# Altium project amino.PrjPcb (part 1 of 2)
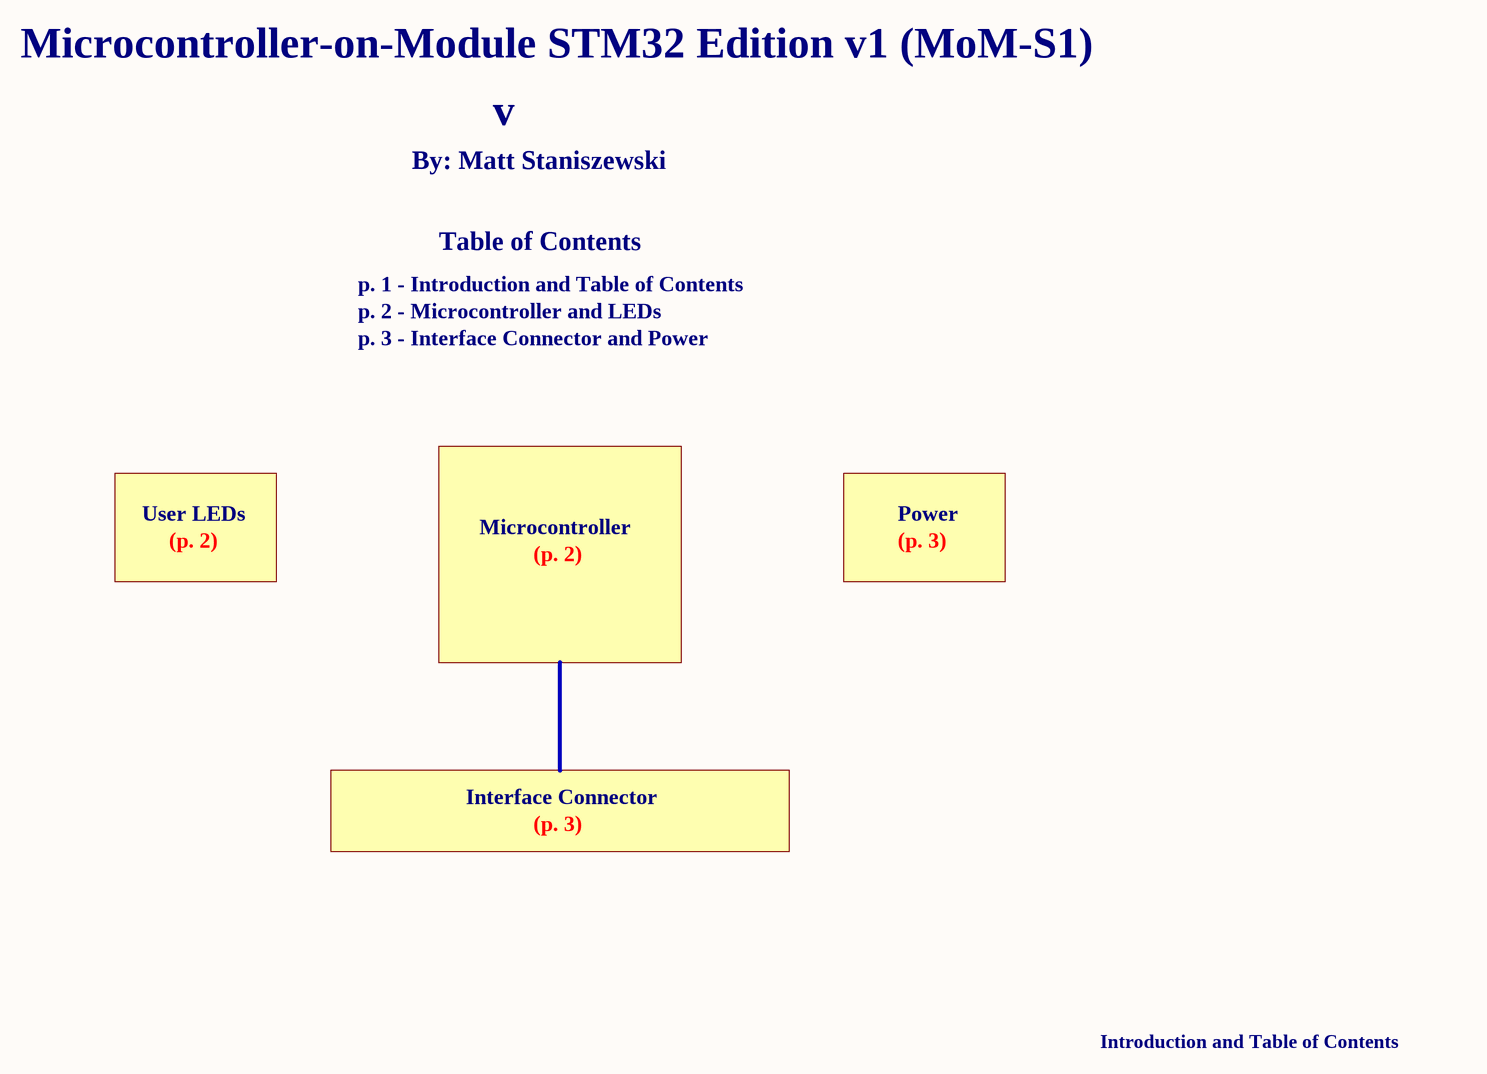
[diagram p0: p1_title_toc.SchDoc]
ProjEngineer: Matt Staniszewski; ProjRev: 1.0.3; XPN: amINO
3 sheets, 78 parts. Net scope: global (net labels, ports and power ports of the same name join across sheets).
Board file: amino.PcbDoc
Sheets:
  p1_title_toc.SchDoc
  p2_mcu_ble.SchDoc
  p3_intf_conn_pwr.SchDoc

## Sheet p1_title_toc.SchDoc
size OrCAD B; DocumentNumber: 1; SheetNumber: 1; SheetTotal: 3

### Notes on the sheet
- Microcontroller-on-Module STM32 Edition v1 (MoM-S1)
- By: Matt Staniszewski
- v
- p. 1 - Introduction and Table of Contents
- Table of Contents
- p. 2 - Microcontroller and LEDs
- p. 3 - Interface Connector and Power
- User LEDs
- (p. 2)
- Microcontroller
- Power
- (p. 3)
- Interface Connector
- Introduction and Table of Contents

## Sheet p2_mcu_ble.SchDoc
size OrCAD B; DocumentNumber: 2; SheetNumber: 2; SheetTotal: 3
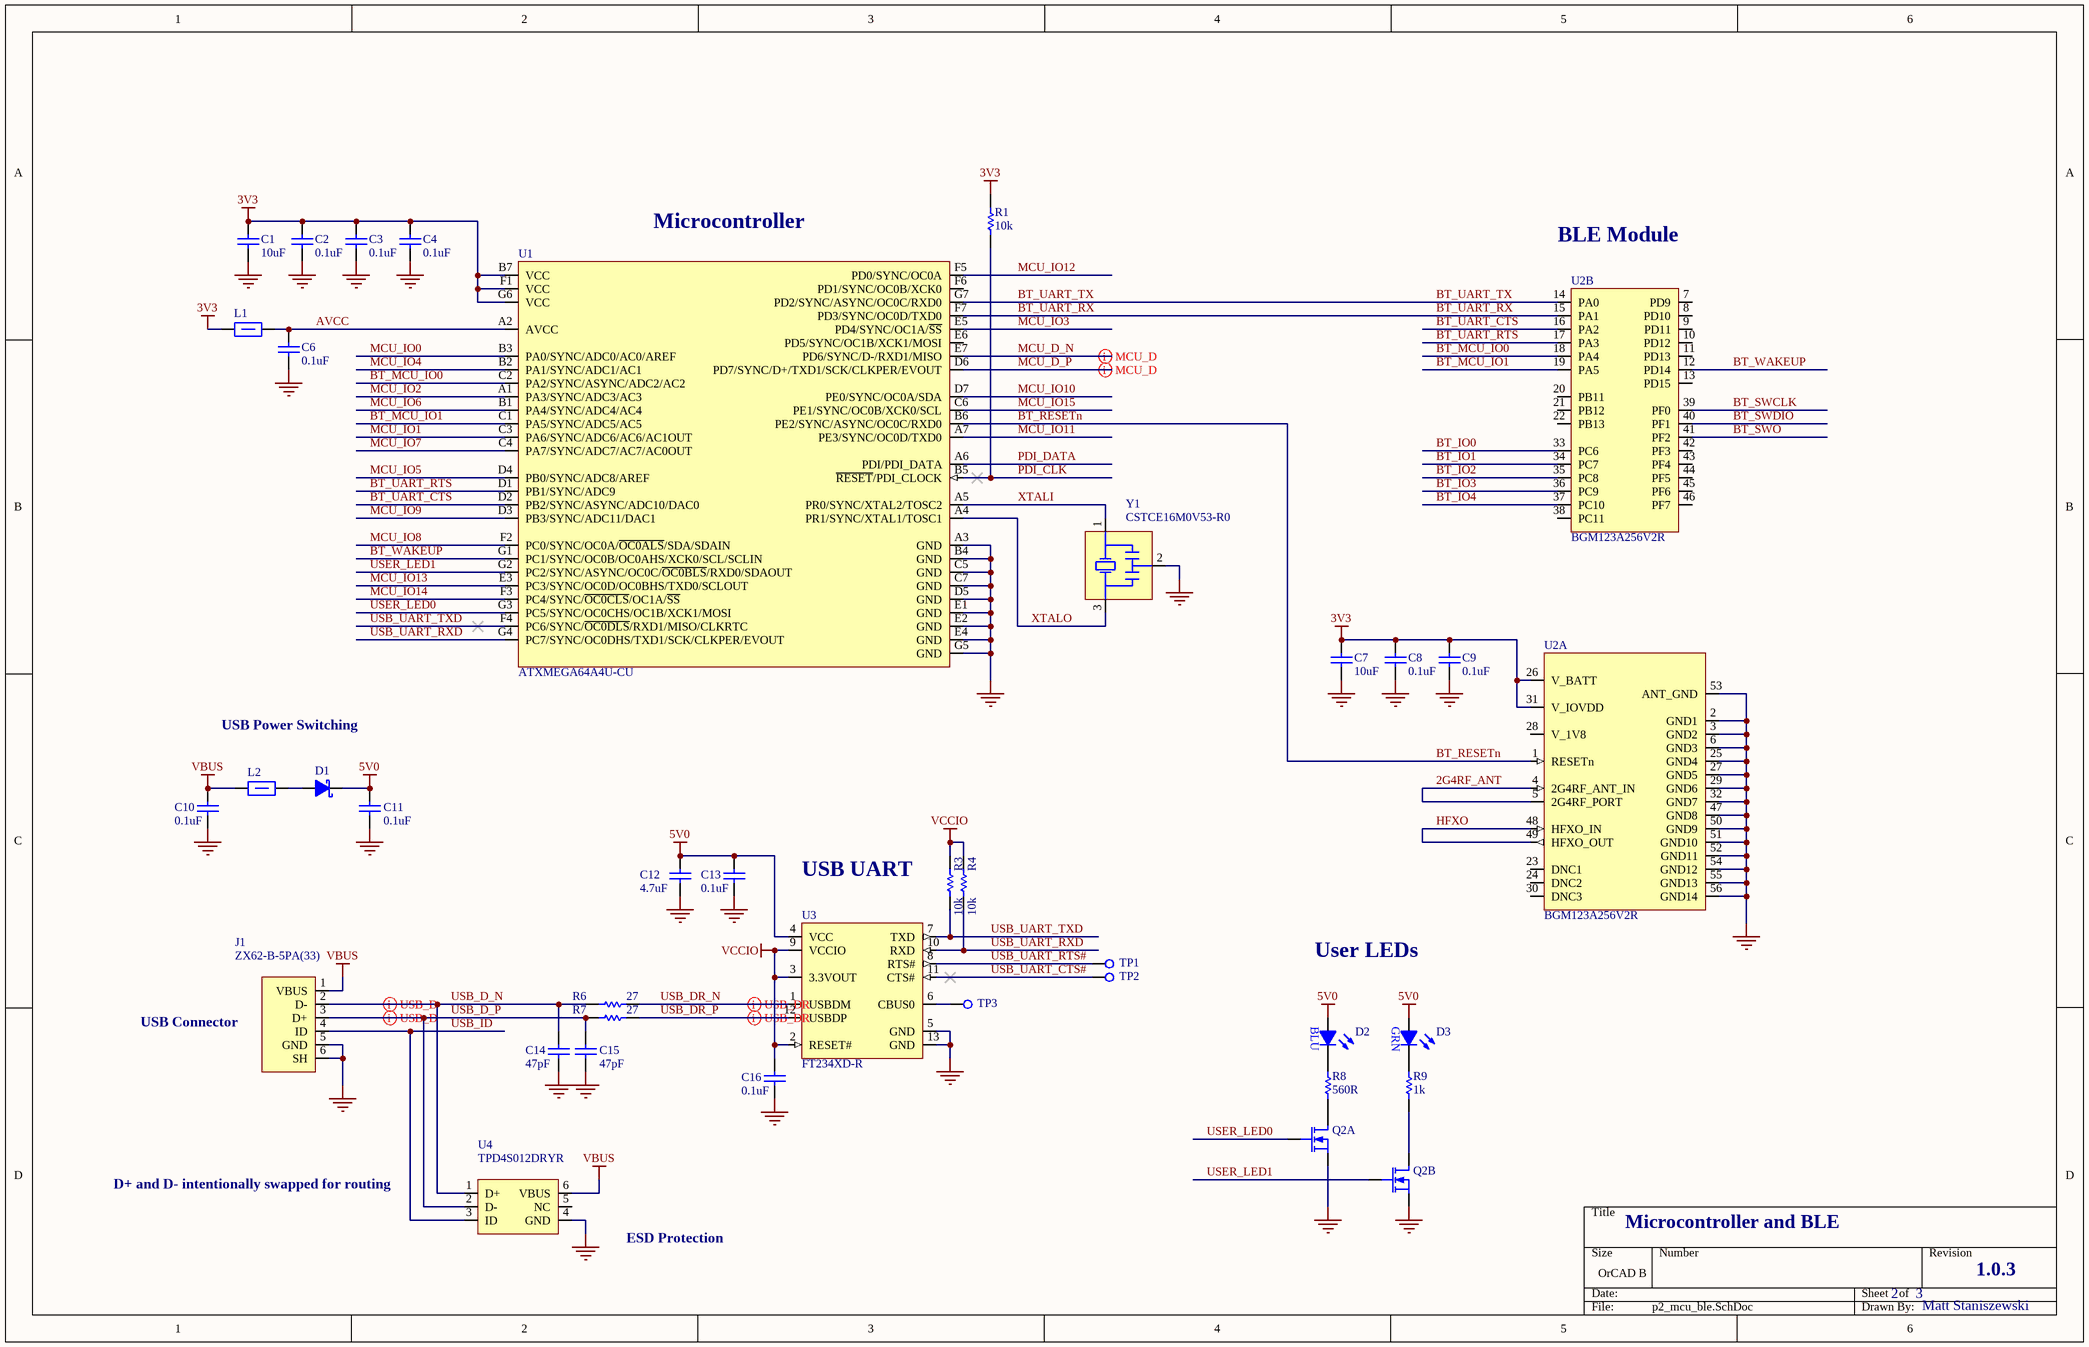
[diagram p1: p2_mcu_ble.SchDoc]

### Parts
(Parts that share a designator on the sheet are numbered #1, #2 ... from top to bottom, then left to right.)
C1  10uF  [C0402]
C2  0.1uF  [C0201]
C3  0.1uF  [C0201]
C4  0.1uF  [C0201]
C6  0.1uF  [C0201]
C7  10uF  [C0402]
C8  0.1uF  [C0201]
C9#1  0.1uF  [C0201]
C10#1  0.1uF  [C0201]
C11#1  0.1uF  [C0201]
C12#1  4.7uF  [C0402]
C13#1  0.1uF  [C0201]
C14#1  47pF  [C0201]
C15  47pF  [C0201]
C16  0.1uF  [C0201]
D1  PMEG2020EPK,315  [NXP_DFN1608D-2]  (value not drawn)
D2  5988091107F  [LED0603]  (value not drawn)
D3#1  5988070107F  [LED0603]  (value not drawn)
J1#1  ZX62-B-5PA(33)  [HRS_MICRO_USB]
L1  BLM15PX601SN1D  [L0402]  (value not drawn)
L2  BLM15PX601SN1D  [L0402]  (value not drawn)
Q2#1  PMDXB600UNE  [NXP_DFN1010B-6]  (value not drawn)  (parts A,B of 2)
R1  10k  [R0201]
R3  10k  [R0201]
R4#1  10k  [R0201]
R6  27  [R0201]
R7  27  [R0201]
R8  560R  [R0201]
R9#1  1k  [R0201]
TP1#1  TP SMT 0.5MM  [TP_SMT_0.5MM]  (value not drawn)
TP2#1  TP SMT 0.5MM  [TP_SMT_0.5MM]  (value not drawn)
TP3#1  TP SMT 0.5MM  [TP_SMT_0.5MM]  (value not drawn)
U1  ATXMEGA64A4U-CU  [MCP_49C2]
U2#1  BGM123A256V2R  [SIL_BGM123]  (parts A,B of 2)
U3#1  FT234XD-R  [FTD_DFN12]
U4  TPD4S012DRYR  [TI_DRY]
Y1  CSTCE16M0V53-R0  [MUR_CSTCE_V]

### Nets
3V3: C1.2 C2.2 C3.2 C4.2 C7.2 C8.2 C9#1.2 L1.1 R1.2 U1.B7(VCC) U1.F1(VCC) U1.G6(VCC) U2#1.26(V_BATT) U2#1.31(V_IOVDD)
5V0: C11#1.2 C12#1.2 C13#1.2 D1.1(K) D2.2(A) D3#1.2(A) U3#1.4(VCC)
GND: C1.1 C2.1 C3.1 C4.1 C6.1 C7.1 C8.1 C9#1.1 C10#1.1 C11#1.1 C12#1.1 C13#1.1 C14#1.1 C15.1 C16.1 J1#1.5(GND) J1#1.6(SH) Q2#1.1(S1) Q2#1.4(S2) U1.A3(GND) U1.B4(GND) U1.C5(GND) U1.C7(GND) U1.D5(GND) U1.E1(GND) U1.E2(GND) U1.E4(GND) U1.G5(GND) U2#1.2(GND1) U2#1.3(GND2) U2#1.6(GND3) U2#1.25(GND4) U2#1.27(GND5) U2#1.29(GND6) U2#1.32(GND7) U2#1.47(GND8) U2#1.50(GND9) U2#1.51(GND10) U2#1.52(GND11) U2#1.53(ANT_GND) U2#1.54(GND12) U2#1.55(GND13) U2#1.56(GND14) U3#1.5(GND) U3#1.13(GND) U4.4(GND) Y1.2
VBUS: C10#1.2 J1#1.1(VBUS) L2.1 U4.6(VBUS)
VCCIO: C16.2 R3.2 R4#1.2 U3#1.2(RESET#) U3#1.3(3.3VOUT) U3#1.9(VCCIO)
2G4RF_ANT: U2#1.4(2G4RF_ANT_IN) U2#1.5(2G4RF_PORT)
AVCC: C6.2 L1.2 U1.A2(AVCC)
BT_IO0: U2#1.33(PC6)
BT_IO1: U2#1.34(PC7)
BT_IO2: U2#1.35(PC8)
BT_IO3: U2#1.36(PC9)
BT_IO4: U2#1.37(PC10)
BT_MCU_IO0: U1.C2(PA2/SYNC/ASYNC/ADC2/AC2) U2#1.18(PA4)
BT_MCU_IO1: U1.C1(PA5/SYNC/ADC5/AC5) U2#1.19(PA5)
BT_RESETn: U1.B6(PE2/SYNC/ASYNC/OC0C/RXD0) U2#1.1(RESETn)
BT_SWCLK: U2#1.39(PF0)
BT_SWDIO: U2#1.40(PF1)
BT_SWO: U2#1.41(PF2)
BT_UART_CTS: U1.D2(PB2/SYNC/ASYNC/ADC10/DAC0) U2#1.16(PA2)
BT_UART_RTS: U1.D1(PB1/SYNC/ADC9) U2#1.17(PA3)
BT_UART_RX: U1.F7(PD3/SYNC/OC0D/TXD0) U2#1.15(PA1)
BT_UART_TX: U1.G7(PD2/SYNC/ASYNC/OC0C/RXD0) U2#1.14(PA0)
BT_WAKEUP: U1.G1(PC1/SYNC/OC0B/OC0AHS/XCK0/SCL/SCLIN) U2#1.12(PD14)
HFXO: U2#1.48(HFXO_IN) U2#1.49(HFXO_OUT)
MCU_D_N: U1.E7(PD6/SYNC/D-/RXD1/MISO)
MCU_D_P: U1.D6(PD7/SYNC/D+/TXD1/SCK/CLKPER/EVOUT)
MCU_IO0: U1.B3(PA0/SYNC/ADC0/AC0/AREF)
MCU_IO1: U1.C3(PA6/SYNC/ADC6/AC6/AC1OUT)
MCU_IO2: U1.A1(PA3/SYNC/ADC3/AC3)
MCU_IO3: U1.E5(PD4/SYNC/OC1A/~{SS})
MCU_IO4: U1.B2(PA1/SYNC/ADC1/AC1)
MCU_IO5: U1.D4(PB0/SYNC/ADC8/AREF)
MCU_IO6: U1.B1(PA4/SYNC/ADC4/AC4)
MCU_IO7: U1.C4(PA7/SYNC/ADC7/AC7/AC0OUT)
MCU_IO8: U1.F2(PC0/SYNC/OC0A/~{OC0ALS}/SDA/SDAIN)
MCU_IO9: U1.D3(PB3/SYNC/ADC11/DAC1)
MCU_IO10: U1.D7(PE0/SYNC/OC0A/SDA)
MCU_IO11: U1.A7(PE3/SYNC/OC0D/TXD0)
MCU_IO12: U1.F5(PD0/SYNC/OC0A)
MCU_IO13: U1.E3(PC3/SYNC/OC0D/OC0BHS/TXD0/SCLOUT)
MCU_IO14: U1.F3(PC4/SYNC/~{OC0CLS}/OC1A/~{SS})
MCU_IO15: U1.C6(PE1/SYNC/OC0B/XCK0/SCL)
PDI_CLK: R1.1 U1.B5(~{RESET}/PDI_CLOCK)
PDI_DATA: U1.A6(PDI/PDI_DATA)
USB_D_N: C14#1.2 J1#1.2(D-) R6.1 U4.1(D+)
USB_D_P: C15.2 J1#1.3(D+) R7.1 U4.2(D-)
USB_DR_N: R6.2 U3#1.1(USBDM)
USB_DR_P: R7.2 U3#1.12(USBDP)
USB_ID: J1#1.4(ID) U4.3(ID)
USB_UART_CTS#: TP2#1.1 U3#1.11(CTS#)
USB_UART_RTS#: TP1#1.1 U3#1.8(RTS#)
USB_UART_RXD: R4#1.1 U1.G4(PC7/SYNC/OC0DHS/TXD1/SCK/CLKPER/EVOUT) U3#1.10(RXD)
USB_UART_TXD: R3.1 U1.F4(PC6/SYNC/~{OC0DLS}/RXD1/MISO/CLKRTC) U3#1.7(TXD)
USER_LED0: Q2#1.2(G1) U1.G3(PC5/SYNC/OC0CHS/OC1B/XCK1/MOSI)
USER_LED1: Q2#1.5(G2) U1.G2(PC2/SYNC/ASYNC/OC0C/~{OC0BLS}/RXD0/SDAOUT)
XTALI: U1.A5(PR0/SYNC/XTAL2/TOSC2) Y1.1
XTALO: U1.A4(PR1/SYNC/XTAL1/TOSC1) Y1.3
NetD1_2: D1.2(A) L2.2
NetD2_1: D2.1(K) R8.2
NetD3#1_1: D3#1.1(K) R9#1.2
NetQ2#1_3: Q2#1.3(S2) R9#1.1
NetQ2#1_6: Q2#1.6(D1) R8.1
NetTP3#1_1: TP3#1.1 U3#1.6(CBUS0)

Not connected (* = marked no-connect by the designer): U1 E6(PD5/SYNC/OC1B/XCK1/MOSI) F6(PD1/SYNC/OC0B/XCK0); U2#1 7(PD9) 8(PD10) 9(PD11) 10(PD12) 11(PD13) 13(PD15) 20(PB11) 21(PB12) 22(PB13) 23(DNC1) 24(DNC2) 28(V_1V8) 30(DNC3) 38(PC11) 42(PF3) 43(PF4) 44(PF5) 45(PF6) 46(PF7); U4 5(NC)

### Layout directives
differential pair: MCU_D_N, MCU_D_P, USB_D_N, USB_D_P, USB_DR_N, USB_DR_P

### Notes on the sheet
- (near U1) Microcontroller
- BLE Module
- USB Power Switching
- USB UART
- User LEDs
- USB Connector
- (near U4) D+ and D- intentionally swapped for routing
- Microcontroller and BLE
- ESD Protection
- (in symbol Blue 0603 LED) BLU
- (in symbol Green 0603 LED) GRN

### Library data of the parts
C1 C7 = 10uF 10V 0402: CAP CER 10UF 10V X5R 0402; Manufacturer: Samsung; Manufacturer Part Number: CL05A106MP5NUNC; Tolerance: 20%; Supplier 1: Digi-Key; Stock 1: 2282441; Pricing 1: 1=0.4, 10=0.277, 100=0.1663, 500=0.1247, 1000=0.1053, 2500=0.0998, 5000=0.0943 (USD); Mount: Surface Mount; Case/Package: 0402; Case Code (Metric): 1005; Case Code (Imperial): 0402; Contact Plating: Nickel,Tin; Min Operating Temperature: -55°C; Max Operating Temperature: 85°C; Package Quantity: 1; Packaging: Tape and Reel; Capacitance: 10uF; Voltage Rating: 10V; Dielectric: X5R; Termination: Wraparound; Length: 1mm; Width: 0.02inch; Thickness: 0.028inch; Depth: 0.5mm; Radiation Hardening: No; Lead Free: Lead Free; ComponentLink1URL: https://datasheet.ciiva.com/25721/cl05a106mp5nunc-25721584.pdf; ComponentLink1Description: https://datasheet.ciiva.com/25721/cl05a106mp5nunc-25721584.pdf; ComponentLink2URL: https://datasheet.ciiva.com/26838/getdatasheetpartid-745310-26838170.pdf; ComponentLink2Description: https://datasheet.ciiva.com/26838/getdatasheetpartid-745310-26838170.pdf; Supplier Part Number 1: 1276-1450-1-ND
C2-C4 C6 C8 C9#1 C10#1 C11#1 C13#1 C16 = 0.1uF 16V 0201: CAP CER 0.1UF 16V X5R 0201; Manufacturer: Murata; Manufacturer Part Number: GRM033R61C104ME84D; Capacitance: 1E-07f; Tolerance: 20%; Supplier 1: Digi-Key; Stock 1: 660567; Pricing 1: 1=0.1, 10=0.029, 100=0.013, 500=0.0093, 1000=0.0073, 2500=0.0067, 5000=0.0061 (USD); Case/Package: 0201; Weight: 1.2E-05oz; Case Code (Metric): 0603; Case Code (Imperial): 0201; Min Operating Temperature: -55°C; Max Operating Temperature: 85°C; Packaging: Tape and Reel; Voltage Rating: 16V; Dielectric: X5R; Termination: SMD/SMT; Voltage Rating (DC): 16V; Package Quantity: 15000; Length: 0.024inch; Height: 0.3mm; Width: 0.3mm; Thickness: 0.013inch; ComponentLink1URL: http://www.mouser.com/ds/2/281/c02e-2905.pdf; ComponentLink1Description: http://www.mouser.com/ds/2/281/c02e-2905.pdf; Supplier Part Number 1: 490-9986-1-ND
C12#1 = 4.7uF 16V 0402: CAP CER 4.7UF 16V X5R 0402; Manufacturer: Samsung; Manufacturer Part Number: CL05A475MO5NUNC; Tolerance: 20%; Supplier 1: Digi-Key; Stock 1: 282710; Pricing 1: 1=0.36, 10=0.248, 100=0.1485, 500=0.1114, 1000=0.0941, 2500=0.0891, 5000=0.0842 (USD); Case/Package: 0402; Case Code (Metric): 1005; Case Code (Imperial): 0402; Min Operating Temperature: -55°C; Max Operating Temperature: 85°C; Packaging: Tape and Reel; Capacitance: 4.7uF; Voltage Rating: 16V; Dielectric: X5R; Length: 0.039inch; Width: 0.02inch; Thickness: 0.022inch; Supplier Part Number 1: 1276-6836-1-ND
C14#1 C15 = 47pF 25V 0201: CAP CER 47PF 25V C0G/NP0 0201; Manufacturer: Murata; Manufacturer Part Number: GRM0335C1E470FA01D; Tolerance: 1%; Supplier 1: Digi-Key; Stock 1: 97008; Pricing 1: 1=0.1, 10=0.019, 100=0.0087, 500=0.0062, 1000=0.0049, 2500=0.0044, 5000=0.0041 (USD); Case/Package: 0201; Case Code (Metric): 0603; Case Code (Imperial): 0201; Min Operating Temperature: -55°C; Max Operating Temperature: 125°C; Capacitance: 47pF; Packaging: Tape and Reel; Voltage Rating: 25V; Package Quantity: 15000; Termination: SMD/SMT; Voltage Rating (DC): 25V; Length: 0.024inch; Width: 0.012inch; Thickness: 0.013inch; ComponentLink1URL: https://datasheet.ciiva.com/29538/partnumbering-e-01-29538333.pdf; ComponentLink1Description: https://datasheet.ciiva.com/29538/partnumbering-e-01-29538333.pdf; Supplier Part Number 1: 490-11298-1-ND
D1 = PMEG2020EPK,315: DIODE SCHOTTKY 20V 2A 2DFN; Manufacturer: NXP Semiconductors; Max Power Dissipation: 1.565W; Peak Reverse Current: 70uA; Reverse Recovery Time: 5ns; Natural Thermal Resistance: 20°C/W; Forward Voltage: 395mV; Max Forward Surge Current (Ifsm): 5A; Element Configuration: Single; Supplier 1: Digi-Key; Manufacturer Part Number: PMEG2020EPK,315; Stock 1: 146420; Pricing 1: 1=0.51, 10=0.387, 100=0.2411, 500=0.165, 1000=0.1269 (USD); Mount: Surface Mount; Case/Package: SMD/SMT; Number of Pins: 2; Min Operating Temperature: -55°C; Max Operating Temperature: 150°C; Package Quantity: 8000; Packaging: Tape and Reel; Forward Current: 2A; Reverse Voltage (DC): 20V; Average Rectified Current: 2A; Max Repetitive Reverse Voltage (Vrrm): 20V; Peak Non-Repetitive Surge Current: 5A; Radiation Hardening: No; ComponentLink1URL: https://datasheet.ciiva.com/29592/pmeg2020epk-29592900.pdf; ComponentLink1Description: https://datasheet.ciiva.com/29592/pmeg2020epk-29592900.pdf; ComponentLink2URL: https://datasheet.ciiva.com/29592/pmeg2020epk-29592901.pdf; ComponentLink2Description: https://datasheet.ciiva.com/29592/pmeg2020epk-29592901.pdf; ComponentLink3URL: https://datasheet.ciiva.com/24111/pmeg2020epk-268880-24111063.pdf; ComponentLink3Description: https://datasheet.ciiva.com/24111/pmeg2020epk-268880-24111063.pdf; ComponentLink4URL: https://datasheet.ciiva.com/25648/pmeg2020epk-25648600.pdf; ComponentLink4Description: https://datasheet.ciiva.com/25648/pmeg2020epk-25648600.pdf; Supplier Part Number 1: 1727-1338-1-ND
D2 = Blue 0603 LED: LED BLUE CLEAR 0603 SMD; Manufacturer: Dialight; Manufacturer Part Number: 598-8091-107F; Lens Colour: Clear,Colorless; Wavelength: 475nm; Luminous Intensity: 140mcd; Viewing Angle: 140°; Forward Voltage: 3.2V; Lens Style: Clear,Diffused,Colorless,Rectangular; Forward Current: 20mA; Dominant Wavelength: 470nm; Number of Elements: 1; Power Dissipation: 70mW; Supplier 1: Digi-Key; Stock 1: 42042; Pricing 1: 1=0.75, 10=0.583, 25=0.4864, 100=0.4189, 250=0.374, 500=0.3216, 1000=0.2483 (USD); Mount: Surface Mount; Case/Package: 0603; Number of Pins: 2; Colour: Blue; Case Code (Metric): 1608; Case Code (Imperial): 0603; Min Operating Temperature: -30°C; Max Operating Temperature: 100°C; Packaging: Tape and Reel; Package Quantity: 4000; Illumination Colour: Blue; Lens Transparency: Clear; Test Current: 20mA; Number of LEDs: 1; Length: 1.6mm; Height: 0.7mm; Width: 0.8mm; Depth: 0.8mm; Radiation Hardening: No; REACH SVHC: No SVHC; Lead Free: Lead Free; ComponentLink1URL: https://datasheet.ciiva.com/15118/getdatasheetpartid-194139-15118048.pdf; ComponentLink1Description: https://datasheet.ciiva.com/15118/getdatasheetpartid-194139-15118048.pdf; ComponentLink2URL: https://datasheet.ciiva.com/2111/598-series-0603-pkg-2111556.pdf; ComponentLink2Description: https://datasheet.ciiva.com/2111/598-series-0603-pkg-2111556.pdf; ComponentLink3URL: https://datasheet.ciiva.com/2111/598-series-0603-pkg-2111557.pdf; ComponentLink3Description: https://datasheet.ciiva.com/2111/598-series-0603-pkg-2111557.pdf; ComponentLink4URL: https://datasheet.ciiva.com/15965/mdei5980603-15965445.pdf; ComponentLink4Description: https://datasheet.ciiva.com/15965/mdei5980603-15965445.pdf; ComponentLink5URL: https://datasheet.ciiva.com/30240/mdei5980603-30240533.pdf; ComponentLink5Description: https://datasheet.ciiva.com/30240/mdei5980603-30240533.pdf; ComponentLink6URL: https://datasheet.ciiva.com/2111/598-series-0603-pkg-2111558.pdf; ComponentLink6Description: https://datasheet.ciiva.com/2111/598-series-0603-pkg-2111558.pdf; ComponentLink7URL: https://datasheet.ciiva.com/7970/25658-7970182.pdf; ComponentLink7Description: https://datasheet.ciiva.com/7970/25658-7970182.pdf; ComponentLink8URL: https://datasheet.ciiva.com/14603/70081992-14603963.pdf; ComponentLink8Description: https://datasheet.ciiva.com/14603/70081992-14603963.pdf; ComponentLink9URL: https://datasheet.ciiva.com/16400/smt-selector-guide-16400478.pdf; ComponentLink9Description: https://datasheet.ciiva.com/16400/smt-selector-guide-16400478.pdf; Supplier Part Number 1: 350-2037-1-ND
D3#1 = Green 0603 LED: LED GREEN CLEAR 0603 SMD; Manufacturer: Dialight; Manufacturer Part Number: 598-8070-107F; Wavelength: 570nm; Luminous Intensity: 20mcd; Viewing Angle: 140°; Forward Voltage: 2V; Lens Style: Clear,Diffused,Colorless,Rectangular; Forward Current: 20mA; Dominant Wavelength: 568nm; Number of Elements: 1; Power Dissipation: 60mW; Supplier 1: Digi-Key; Stock 1: 147636; Pricing 1: 1=0.45, 10=0.327, 25=0.2504, 100=0.1634, 250=0.1198, 500=0.1016, 1000=0.0835 (USD); Mount: Surface Mount; Case/Package: 0603; Number of Pins: 2; Colour: Green; Case Code (Metric): 1608; Case Code (Imperial): 0603; Lens Colour: Clear; Min Operating Temperature: -30°C; Max Operating Temperature: 100°C; Packaging: Tape and Reel; Package Quantity: 4000; Illumination Colour: Green; Test Current: 20mA; Number of LEDs: 1; Length: 1.6mm; Height: 0.7mm; Width: 0.8mm; Depth: 0.8mm; Radiation Hardening: No; REACH SVHC: No SVHC; Lead Free: Lead Free; ComponentLink1URL: https://datasheet.ciiva.com/4688/598-selectorguide-18902-4688880.pdf; ComponentLink1Description: https://datasheet.ciiva.com/4688/598-selectorguide-18902-4688880.pdf; ComponentLink2URL: https://datasheet.ciiva.com/11774/0900766b80ae2975-11774257.pdf; ComponentLink2Description: https://datasheet.ciiva.com/11774/0900766b80ae2975-11774257.pdf; ComponentLink3URL: https://datasheet.ciiva.com/1243/1484480-1243893.pdf; ComponentLink3Description: https://datasheet.ciiva.com/1243/1484480-1243893.pdf; ComponentLink4URL: https://datasheet.ciiva.com/2110/598-series-0603-pkg-2110165.pdf; ComponentLink4Description: https://datasheet.ciiva.com/2110/598-series-0603-pkg-2110165.pdf; ComponentLink5URL: https://datasheet.ciiva.com/1243/1484480-1243894.pdf; ComponentLink5Description: https://datasheet.ciiva.com/1243/1484480-1243894.pdf; ComponentLink6URL: https://datasheet.ciiva.com/2110/598-series-0603-pkg-2110166.pdf; ComponentLink6Description: https://datasheet.ciiva.com/2110/598-series-0603-pkg-2110166.pdf; ComponentLink7URL: https://datasheet.ciiva.com/2110/598-series-0603-pkg-2110167.pdf; ComponentLink7Description: https://datasheet.ciiva.com/2110/598-series-0603-pkg-2110167.pdf; ComponentLink8URL: https://datasheet.ciiva.com/14605/70081990-14605530.pdf; ComponentLink8Description: https://datasheet.ciiva.com/14605/70081990-14605530.pdf; ComponentLink9URL: https://datasheet.ciiva.com/15965/mdei5980603-15965419.pdf; ComponentLink9Description: https://datasheet.ciiva.com/15965/mdei5980603-15965419.pdf; ComponentLink10URL: https://datasheet.ciiva.com/30188/mdei5980603-30188139.pdf; ComponentLink10Description: https://datasheet.ciiva.com/30188/mdei5980603-30188139.pdf; ComponentLink11URL: https://datasheet.ciiva.com/15117/getdatasheetpartid-146438-15117836.pdf; ComponentLink11Description: https://datasheet.ciiva.com/15117/getdatasheetpartid-146438-15117836.pdf; ComponentLink12URL: https://datasheet.ciiva.com/22749/1484480-22749228.pdf; ComponentLink12Description: https://datasheet.ciiva.com/22749/1484480-22749228.pdf; ComponentLink13URL: https://datasheet.ciiva.com/16400/smt-selector-guide-16400463.pdf; ComponentLink13Description: https://datasheet.ciiva.com/16400/smt-selector-guide-16400463.pdf; Supplier Part Number 1: 350-2035-1-ND
J1#1 = USB Micro B: CONN RCPT USB MICRO B SMD R/A; Manufacturer: Hirose; Number of Contacts: 5; Gender: Receptacle; Current Rating: 1.8A; Mating Cycles: 10000; Supplier 1: Digi-Key; Manufacturer Part Number: ZX62-B-5PA(33); Stock 1: 63782; Pricing 1: 1=0.84, 10=0.792, 25=0.7128, 50=0.6336, 100=0.6072, 250=0.5544, 500=0.528, 1000=0.4356 (USD); Contact Material: Copper; Contact Plating: Gold; Packaging: Tape and Reel; Connector Type: USB; Orientation: Right Angle; REACH SVHC: Unknown; Lead Free: Lead Free; ComponentLink1URL: http://www.farnell.com/datasheets/2060515.pdf; ComponentLink1Description: http://www.farnell.com/datasheets/2060515.pdf; Supplier Part Number 1: H125270CT-ND
L1 L2 = BLM15PX601SN1D: FERRITE BEAD 600 OHM 0402 1LN; Manufacturer: Murata; Material: Steel; Impedance: 600R; Tolerance: 25%; Current Rating: 900mA; Number of Lines: 1; DC Resistance (DCR): 230mR; Test Frequency: 100MHz; Supplier 1: Digi-Key; Manufacturer Part Number: BLM15PX601SN1D; Stock 1: 156023; Pricing 1: 1=0.15, 10=0.123, 25=0.0956, 50=0.0792, 100=0.0682, 250=0.0546, 500=0.0491, 1000=0.0409, 5000=0.0382 (USD); Case/Package: 0402; Number of Pins: 2; Case Code (Metric): 1005; Case Code (Imperial): 0402; Min Operating Temperature: -55°C; Max Operating Temperature: 125°C; Package Quantity: 10000; Packaging: Tape and Reel; Max Current Rating: 900mA; Max DC Current: 900mA; Termination: SMD/SMT; Number of Circuits: 1; Length: 1mm; Height: 0.5mm; Width: 0.5mm; Lead Free: Lead Free; ComponentLink1URL: https://datasheet.ciiva.com/41860/l0110e-41860698.pdf; ComponentLink1Description: https://datasheet.ciiva.com/41860/l0110e-41860698.pdf; ComponentLink2URL: https://datasheet.ciiva.com/41449/001172217-da-01-en-drossel-0402-600r-1-0x0-5mm-10000st-41449505.pdf; ComponentLink2Description: https://datasheet.ciiva.com/41449/001172217-da-01-en-drossel-0402-600r-1-0x0-5mm-10000st-41449505.pdf; Supplier Part Number 1: 490-9657-1-ND
Q2#1 = PMDXB600UNE: MOSFET 2N-CH 20V 0.6A 6DFN; Manufacturer: NXP Semiconductors; Rds On Max: 620mR; Input Capacitance: 21.3pF; Continuous Drain Current (ID): 600mA; Max Power Dissipation: 265mW; Threshold Voltage: 700mV; Supplier 1: Digi-Key; Manufacturer Part Number: PMDXB600UNE; Stock 1: 27879; Pricing 1: 1=0.65, 10=0.552, 100=0.4124, 500=0.324, 1000=0.2504 (USD); Case/Package: 600; Number of Pins: 6; Min Operating Temperature: -55°C; Max Operating Temperature: 150°C; Packaging: Tape and Reel; Drain to Source Voltage (Vdss): 20V; REACH SVHC: No SVHC; ComponentLink1URL: https://datasheet.ciiva.com/29589/pmdxb600une-29589931.pdf; ComponentLink1Description: https://datasheet.ciiva.com/29589/pmdxb600une-29589931.pdf; ComponentLink2URL: https://datasheet.ciiva.com/29589/pmdxb600une-29589932.pdf; ComponentLink2Description: https://datasheet.ciiva.com/29589/pmdxb600une-29589932.pdf; ComponentLink3URL: https://datasheet.ciiva.com/29589/pmdxb600une-29589933.pdf; ComponentLink3Description: https://datasheet.ciiva.com/29589/pmdxb600une-29589933.pdf; Supplier Part Number 1: 1727-1470-1-ND
R1 R3 R4#1 = 10k 0201: RES SMD 10K OHM 1% 1/20W 0201; Manufacturer: Panasonic ECG; Manufacturer Part Number: ERJ-1GEF1002C; Resistance: 10KR; Power Rating: 50mW; Voltage Rating: 25V; Temperature Coefficient: 200ppm/°C; Voltage Rating (DC): 15V; Supplier 1: Digi-Key; Stock 1: 4709989; Pricing 1: 1=0.1, 10=0.059, 100=0.024, 1000=0.0108, 2500=0.0094, 5000=0.0077 (USD); Mount: Surface Mount; Case/Package: 0201; Case Code (Metric): 0603; Case Code (Imperial): 0201; Contact Plating: Tin; Min Operating Temperature: -55°C; Max Operating Temperature: 125°C; Tolerance: 1%; Packaging: Tape and Reel; Package Quantity: 15000; Composition: Thick Film; Number of Terminations: 2; Termination: SMD/SMT; Military Standard: Not; Max Power Dissipation: 50mW; Length: 0.6mm; Height: 0.23mm; Width: 0.012inch; Depth: 0.3mm; Radiation Hardening: No; REACH SVHC: Unknown; Lead Free: Lead Free; ComponentLink1URL: https://datasheet.ciiva.com/16427/erj-1gef1002c-16427252.pdf; ComponentLink1Description: https://datasheet.ciiva.com/16427/erj-1gef1002c-16427252.pdf; ComponentLink2URL: https://datasheet.ciiva.com/30111/aoa0000ce2-30111653.pdf; ComponentLink2Description: https://datasheet.ciiva.com/30111/aoa0000ce2-30111653.pdf; ComponentLink3URL: https://datasheet.ciiva.com/16775/70260683-16775527.pdf; ComponentLink3Description: https://datasheet.ciiva.com/16775/70260683-16775527.pdf; ComponentLink4URL: https://datasheet.ciiva.com/22785/1678796-22785991.pdf; ComponentLink4Description: https://datasheet.ciiva.com/22785/1678796-22785991.pdf; ComponentLink5URL: https://datasheet.ciiva.com/7830/1678796-7830952.pdf; ComponentLink5Description: https://datasheet.ciiva.com/7830/1678796-7830952.pdf; ComponentLink6URL: https://datasheet.ciiva.com/16770/70260683-16770095.pdf; ComponentLink6Description: https://datasheet.ciiva.com/16770/70260683-16770095.pdf; Supplier Part Number 1: P10.0KABCT-ND
R6 R7 = 27R 0201: RES SMD 27 OHM 1% 1/20W 0201; Manufacturer: Panasonic ECG; Manufacturer Part Number: ERJ-1GEF27R0C; Resistance: 27R; Temperature Coefficient: 200ppm/°C; Power Rating: 50mW; Voltage Rating: 25V; Voltage Rating (DC): 15V; Supplier 1: Digi-Key; Stock 1: 66085; Pricing 1: 1=0.1, 10=0.059, 100=0.024, 1000=0.0108, 2500=0.0094, 5000=0.0077 (USD); Mount: Surface Mount; Case/Package: 0201; Contact Plating: Tin; Case Code (Metric): 0603; Case Code (Imperial): 0201; Min Operating Temperature: -55°C; Max Operating Temperature: 125°C; Tolerance: 1%; Composition: Thick Film; Packaging: Tape and Reel; Package Quantity: 1; Number of Terminations: 2; Military Standard: Not; Max Power Dissipation: 50mW; Length: 0.6mm; Height: 0.01inch; Width: 0.012inch; Depth: 0.3mm; Radiation Hardening: No; Lead Free: Lead Free; ComponentLink1URL: https://datasheet.ciiva.com/2526/erj-g-r-e-rev08-2526739.pdf; ComponentLink1Description: https://datasheet.ciiva.com/2526/erj-g-r-e-rev08-2526739.pdf; ComponentLink2URL: https://datasheet.ciiva.com/2526/erj-g-r-e-rev08-2526740.pdf; ComponentLink2Description: https://datasheet.ciiva.com/2526/erj-g-r-e-rev08-2526740.pdf; ComponentLink3URL: https://datasheet.ciiva.com/2526/erj-g-r-e-rev08-2526741.pdf; ComponentLink3Description: https://datasheet.ciiva.com/2526/erj-g-r-e-rev08-2526741.pdf; ComponentLink4URL: https://datasheet.ciiva.com/30072/aoa0000ce2-30072301.pdf; ComponentLink4Description: https://datasheet.ciiva.com/30072/aoa0000ce2-30072301.pdf; Supplier Part Number 1: P27.0ABCT-ND
R8 = 560R 0201: RES SMD 560 OHM 1% 1/20W 0201; Manufacturer: Panasonic ECG; Manufacturer Part Number: ERJ-1GEF5600C; Power Rating: 50mW; Voltage Rating: 25V; Temperature Coefficient: 200ppm/°C; Voltage Rating (DC): 15V; Supplier 1: Digi-Key; Stock 1: 11988; Pricing 1: 1=0.1, 10=0.059, 100=0.024, 1000=0.0108, 2500=0.0094, 5000=0.0077 (USD); Mount: Surface Mount; Case/Package: 0201; Case Code (Imperial): 0201; Case Code (Metric): 0603; Contact Plating: Tin; Min Operating Temperature: -55°C; Max Operating Temperature: 125°C; Packaging: Tape and Reel; Resistance: 560R; Tolerance: 1%; Package Quantity: 15000; Composition: Thick Film; Number of Terminations: 2; Military Standard: Not; Max Power Dissipation: 50mW; Length: 0.6mm; Height: 0.01inch; Width: 0.3mm; Depth: 0.3mm; Radiation Hardening: No; Lead Free: Lead Free; ComponentLink1URL: https://datasheet.ciiva.com/2440/erj-g-r-e-rev08-2440588.pdf; ComponentLink1Description: https://datasheet.ciiva.com/2440/erj-g-r-e-rev08-2440588.pdf; ComponentLink2URL: https://datasheet.ciiva.com/2440/erj-g-r-e-rev08-2440589.pdf; ComponentLink2Description: https://datasheet.ciiva.com/2440/erj-g-r-e-rev08-2440589.pdf; ComponentLink3URL: https://datasheet.ciiva.com/2440/erj-g-r-e-rev08-2440590.pdf; ComponentLink3Description: https://datasheet.ciiva.com/2440/erj-g-r-e-rev08-2440590.pdf; Supplier Part Number 1: P560ABCT-ND
R9#1 = 1k 0201: RES SMD 1K OHM 1% 1/20W 0201; Manufacturer: Panasonic ECG; Manufacturer Part Number: ERJ-1GEF1001C; Resistance: 1KR; Power Rating: 50mW; Voltage Rating: 25V; Temperature Coefficient: 200ppm/°C; Voltage Rating (DC): 15V; Supplier 1: Digi-Key; Stock 1: 3138057; Pricing 1: 1=0.1, 10=0.059, 100=0.024, 1000=0.0108, 2500=0.0094, 5000=0.0077 (USD); Mount: Surface Mount; Case/Package: 0201; Case Code (Metric): 0603; Case Code (Imperial): 0201; Contact Plating: Tin; Min Operating Temperature: -55°C; Max Operating Temperature: 125°C; Packaging: Tape and Reel; Tolerance: 1%; Package Quantity: 15000; Composition: Thick Film; Number of Terminations: 2; Termination: SMD/SMT; Military Standard: Not; Max Power Dissipation: 50mW; Length: 0.6mm; Height: 0.23mm; Width: 0.012inch; Depth: 0.3mm; Radiation Hardening: No; REACH SVHC: Unknown; Lead Free: Lead Free; ComponentLink1URL: https://datasheet.ciiva.com/28532/1694929-28532042.pdf; ComponentLink1Description: https://datasheet.ciiva.com/28532/1694929-28532042.pdf; ComponentLink2URL: https://datasheet.ciiva.com/16763/70260683-16763516.pdf; ComponentLink2Description: https://datasheet.ciiva.com/16763/70260683-16763516.pdf; ComponentLink3URL: https://datasheet.ciiva.com/16199/erj-1gef1001c-16199565.pdf; ComponentLink3Description: https://datasheet.ciiva.com/16199/erj-1gef1001c-16199565.pdf; ComponentLink4URL: https://datasheet.ciiva.com/30155/aoa0000ce2-30155870.pdf; ComponentLink4Description: https://datasheet.ciiva.com/30155/aoa0000ce2-30155870.pdf; ComponentLink5URL: https://datasheet.ciiva.com/7942/1678796-7942463.pdf; ComponentLink5Description: https://datasheet.ciiva.com/7942/1678796-7942463.pdf; ComponentLink6URL: https://datasheet.ciiva.com/16782/70260683-16782463.pdf; ComponentLink6Description: https://datasheet.ciiva.com/16782/70260683-16782463.pdf; Supplier Part Number 1: P1.00KABCT-ND
TP1#1 TP2#1 TP3#1 = TP SMT 0.5MM: 0.5mm SMT Test Point
U1 = ATXMEGA64A4U-CU: IC MCU 8BIT 64KB FLASH 49VFBGA; Manufacturer: Microchip / Atmel; Manufacturer Part Number: ATXMEGA64A4U-CUR; RAM Size: 4KB; Interface: I2C,SPI,USB,IrDA,UART,USART; Number of Timers/Counters: 5; Max Supply Voltage: 3.6V; Min Supply Voltage: 1.6V; Data Bus Width: 8b; Frequency: 32MHz; Number of Programmable I/O: 34; Oscillator Type: Internal; Watchdog Timer: Yes; Peripherals: Brown-out Detect/Reset,POR,PWM,WDT,DMA; Supplier 1: Digi-Key; Stock 1: 4285; Pricing 1: 1=4.65, 25=4.2632, 100=3.864 (USD); Mount: Surface Mount; Min Operating Temperature: -40°C; Max Operating Temperature: 85°C; Packaging: Tape and Reel; Package Quantity: 2000; Max Frequency: 32MHz; Memory Type: FLASH; Memory Size: 64KB; ComponentLink1URL: https://datasheet.ciiva.com/24017/atmel-8387-8-and16-bit-avr-microcontroller-xmega-a-259135-24017304.pdf; ComponentLink1Description: https://datasheet.ciiva.com/24017/atmel-8387-8-and16-bit-avr-microcontroller-xmega-a-259135-24017304.pdf; Supplier Part Number 1: ATXMEGA64A4U-CURCT-ND
U2#1 = BGM123A256V2R: BGM123 BLUETOOTH SIP MODULE, 3 D; Manufacturer: Silicon Labs; Supplier 1: Digi-Key; Manufacturer Part Number: BGM123A256V2R; Stock 1: 0; Supplier Part Number 1: 336-3808-1-ND
U3#1 = FT234XD-R: IC USB SERIAL BASIC UART 12DFN; Manufacturer: FTDI; Min Supply Voltage: 2.97V; Max Supply Voltage: 5.5V; Interface: USB,UART; Operating Supply Current: 8mA; Number of Transceivers: 1; Supply Voltage: 5V; Data Rate: 3Mbps; Supplier 1: Digi-Key; Manufacturer Part Number: FT234XD-R; Stock 1: 78937; Pricing 1: 1=2.04, 25=1.97, 100=1.9, 250=1.71, 500=1.54, 1000=1.46, 2500=1.4214 (USD); Case/Package: DFN; Number of Pins: 12; Min Operating Temperature: -40°C; Max Operating Temperature: 85°C; Packaging: Tape and Reel; Package Quantity: 5000; Number of Ports: 1; Length: 3mm; Height: 0.75mm; Width: 3mm; REACH SVHC: No SVHC; Lead Free: Lead Free; ComponentLink1URL: https://datasheet.ciiva.com/15013/ds-ft234xd-15013687.pdf; ComponentLink1Description: https://datasheet.ciiva.com/15013/ds-ft234xd-15013687.pdf; ComponentLink2URL: https://datasheet.ciiva.com/15013/ds-ft234xd-15013688.pdf; ComponentLink2Description: https://datasheet.ciiva.com/15013/ds-ft234xd-15013688.pdf; ComponentLink3URL: https://datasheet.ciiva.com/15013/ds-ft234xd-15013689.pdf; ComponentLink3Description: https://datasheet.ciiva.com/15013/ds-ft234xd-15013689.pdf; ComponentLink4URL: https://datasheet.ciiva.com/46410/1812674-46410091.pdf; ComponentLink4Description: https://datasheet.ciiva.com/46410/1812674-46410091.pdf; Supplier Part Number 1: 768-1178-1-ND
U4 = TPD4S012DRYR: IC 4CH ESD SOLUTION W/CLAMP 6SON; Manufacturer: Texas Instruments; Capacitance: 15pF; Direction: Unidirectional; Supply Voltage: 950mV; Number of Circuits: 4; Breakdown Voltage: 24V; Max Power Dissipation: 60W; Working Voltage: 19V; Min Breakdown Voltage: 20V; ESD Protection: Yes; Test Current: 1mA; Peak Pulse Current: 3A; Interface: USB; Supplier 1: Digi-Key; Manufacturer Part Number: TPD4S012DRYR; Stock 1: 85253; Pricing 1: 1=0.77, 10=0.675, 100=0.5171, 500=0.4088, 1000=0.3271 (USD); Number of Pins: 6; Min Operating Temperature: -40°C; Max Operating Temperature: 85°C; Packaging: Tape and Reel; Package Quantity: 5000; Polarity: Unidirectional; Number of Channels: 4; Termination: SMD/SMT; Peak Pulse Power: 60W; Length: 1.45mm; Height: 0.55mm; Width: 1.05mm; Depth: 1mm; Radiation Hardening: No; REACH SVHC: No SVHC; Lead Free: Lead Free; ComponentLink1URL: https://datasheet.ciiva.com/361/tpd4s012-361280.pdf; ComponentLink1Description: https://datasheet.ciiva.com/361/tpd4s012-361280.pdf; ComponentLink2URL: https://datasheet.ciiva.com/4479/slvs928a-120928-4479536.pdf; ComponentLink2Description: https://datasheet.ciiva.com/4479/slvs928a-120928-4479536.pdf; ComponentLink3URL: https://datasheet.ciiva.com/25956/tpd4s012-25956897.pdf; ComponentLink3Description: https://datasheet.ciiva.com/25956/tpd4s012-25956897.pdf; ComponentLink4URL: https://datasheet.ciiva.com/1271/1719848-1271898.pdf; ComponentLink4Description: https://datasheet.ciiva.com/1271/1719848-1271898.pdf; ComponentLink5URL: https://datasheet.ciiva.com/46381/1857625-46381802.pdf; ComponentLink5Description: https://datasheet.ciiva.com/46381/1857625-46381802.pdf; ComponentLink6URL: https://datasheet.ciiva.com/28496/tpd4s012-28496124.pdf; ComponentLink6Description: https://datasheet.ciiva.com/28496/tpd4s012-28496124.pdf; ComponentLink7URL: https://datasheet.ciiva.com/1268/tpd4s012-1268381.pdf; ComponentLink7Description: https://datasheet.ciiva.com/1268/tpd4s012-1268381.pdf; ComponentLink8URL: https://datasheet.ciiva.com/361/tpd4s012-361278.pdf; ComponentLink8Description: https://datasheet.ciiva.com/361/tpd4s012-361278.pdf; ComponentLink9URL: https://datasheet.ciiva.com/15104/getdatasheetpartid-293634-15104046.pdf; ComponentLink9Description: https://datasheet.ciiva.com/15104/getdatasheetpartid-293634-15104046.pdf; ComponentLink10URL: https://datasheet.ciiva.com/22621/1857625-22621486.pdf; ComponentLink10Description: https://datasheet.ciiva.com/22621/1857625-22621486.pdf; ComponentLink11URL: https://datasheet.ciiva.com/361/tpd4s012-361279.pdf; ComponentLink11Description: https://datasheet.ciiva.com/361/tpd4s012-361279.pdf; Supplier Part Number 1: 296-24244-1-ND
Y1 = 16MHz Resonator: CER RES 16.0000MHZ 15PF SMD; Manufacturer: Murata; Frequency: 16MHz; Frequency Tolerance: 0.5%; Impedance: 40R; Frequency Stability: 0.3%; Supplier 1: Digi-Key; Manufacturer Part Number: CSTCE16M0V53-R0; Stock 1: 104178; Pricing 1: 1=0.5, 10=0.42, 50=0.3776, 100=0.3357, 500=0.3189, 1000=0.2686 (USD); Case/Package: SMD/SMT; Number of Pins: 3; Contact Plating: Gold; Min Operating Temperature: -20°C; Max Operating Temperature: 80°C; Self Resonant Frequency: 16MHz; Load Capacitance: 15pF; Tolerance: 0.5%; Package Quantity: 3000; Capacitance: 15pF; Packaging: Tape and Reel; Termination: SMD/SMT; Composition: Ceramic; Length: 0.126inch; Height: 0.039inch; Width: 0.051inch; REACH SVHC: No SVHC; Lead Free: Lead Free; ComponentLink1URL: https://datasheet.ciiva.com/18183/getdatasheetpartid-152969-18183272.pdf; ComponentLink1Description: https://datasheet.ciiva.com/18183/getdatasheetpartid-152969-18183272.pdf; ComponentLink2URL: https://datasheet.ciiva.com/884/p16e-884477.pdf; ComponentLink2Description: https://datasheet.ciiva.com/884/p16e-884477.pdf; ComponentLink3URL: https://datasheet.ciiva.com/1361/1506176-1361293.pdf; ComponentLink3Description: https://datasheet.ciiva.com/1361/1506176-1361293.pdf; ComponentLink4URL: https://datasheet.ciiva.com/884/p16e-884478.pdf; ComponentLink4Description: https://datasheet.ciiva.com/884/p16e-884478.pdf; ComponentLink5URL: https://datasheet.ciiva.com/884/p16e-884479.pdf; ComponentLink5Description: https://datasheet.ciiva.com/884/p16e-884479.pdf; ComponentLink6URL: https://datasheet.ciiva.com/14132/ceralock-eng-bro-14132735.pdf; ComponentLink6Description: https://datasheet.ciiva.com/14132/ceralock-eng-bro-14132735.pdf; ComponentLink7URL: https://datasheet.ciiva.com/16216/l0430e-16216847.pdf; ComponentLink7Description: https://datasheet.ciiva.com/16216/l0430e-16216847.pdf; Supplier Part Number 1: 490-1198-1-ND